# Altium schematic sheet Sheet.SchDoc
size A4; SheetNumber: 1; SheetTotal: 1
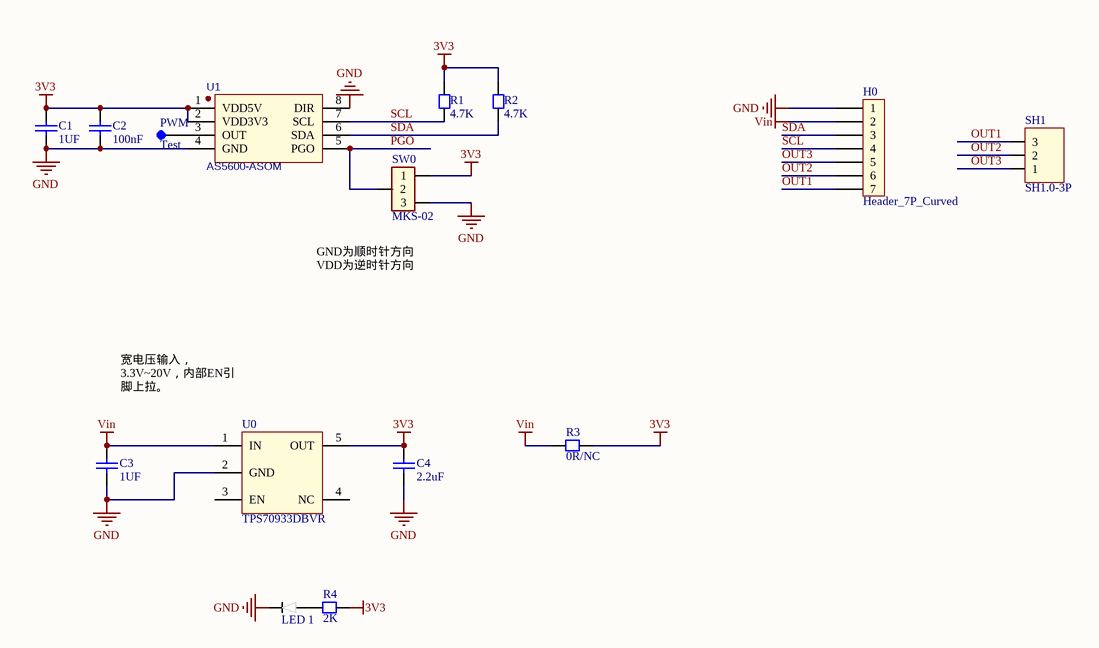
[diagram p0: Sheet.SchDoc]

## Parts
C1  1UF  [CC1608-0603]
C2  100nF  [CC1608-0603]
C3  1UF  [CC1608-0603]
C4  2.2uF  [CC1608-0603]
H0  Header_7P_Curved  [Header_2_54_7PW]
LED_1  LED 0603  [LED 0603]  (value not drawn)
PWM  Test  [TEST2]
R1  4.7K  [CR1608-0603]
R2  4.7K  [CR1608-0603]
R3  0R/NC  [CR1608-0603]
R4  2K  [CR1608-0603]
SH1  SH1.0-3P  [SH1.0-3P]
SW0  MKS-02  [MSK-02]
U0  TPS70933DBVR  [SOT23-5]
U1  AS5600-ASOM  [SOIC-8]

## Nets
3V3: C1.2 C2.2 C4.2 R1.2 R2.2 R3.1 R4.2 SW0.1 U0.5(OUT) U1.1(VDD5V) U1.2(VDD3V3)
GND: C1.1 C2.1 C3.1 C4.1 H0.1 LED_1.2 SW0.3 U0.2(GND) U1.4(GND) U1.8(DIR)
Vin: C3.2 H0.2 R3.2 U0.1(IN)
OUT1: H0.7 SH1.3
OUT2: H0.6 SH1.2
OUT3: H0.5 SH1.1
PGO: SW0.2 U1.5(PGO)
SCL: H0.4 R1.1 U1.7(SCL)
SDA: H0.3 R2.1 U1.6(SDA)
NetLED_1_1: LED_1.1 R4.1
NetPWM_1: PWM.1 U1.3(OUT)

Not connected (* = marked no-connect by the designer): U0 3(EN) 4(NC)

## Notes on the sheet
- (near SW0) GND为顺时针方向
  VDD为逆时针方向
- 宽电压输入，3.3V~20V，内部EN引脚上拉。

## Library data of the parts
C1-C4 = Cap Chip 0603: 0603封装的电容; Published: 8-Jun-2000; Revision: July-2002: Re-released for DXP Platform.; Publisher: Altium Limited
H0 = Header_7P_Curved: 弯的6P排针
PWM = Test: 测试焊接点
R1-R4 = Resistor Chip 0603: 0603封装电阻; Published: 8-Jun-2000; Revision: July-2002: Re-released for DXP Platform.; Publisher: Altium Limited
SH1 = SH1.0-3P: 间距为1mm的端子
SW0 = sw-MSK-02: 微型拨动开关
U0 = TPS70933DBVR: LDO 3.3V 150mA低压差线性稳压器芯片 超低IQ 输入2.7~30V
U1 = AS5600-ASOM: BOM_Manufacturer: Ams; SMT Type: Extend; BOM_Supplier: LCSC; BOM_Manufacturer Part: AS5600-ASOM; BOM_Supplier Part: C79815; BOM_LCSC Assembly: Yes; spicePre: U; spiceSymbolName: AS5600-ASOM